# Altium schematic sheet STM32.SchDoc
size 368 x 200 mm; SheetNumber: 1; SheetTotal: 2
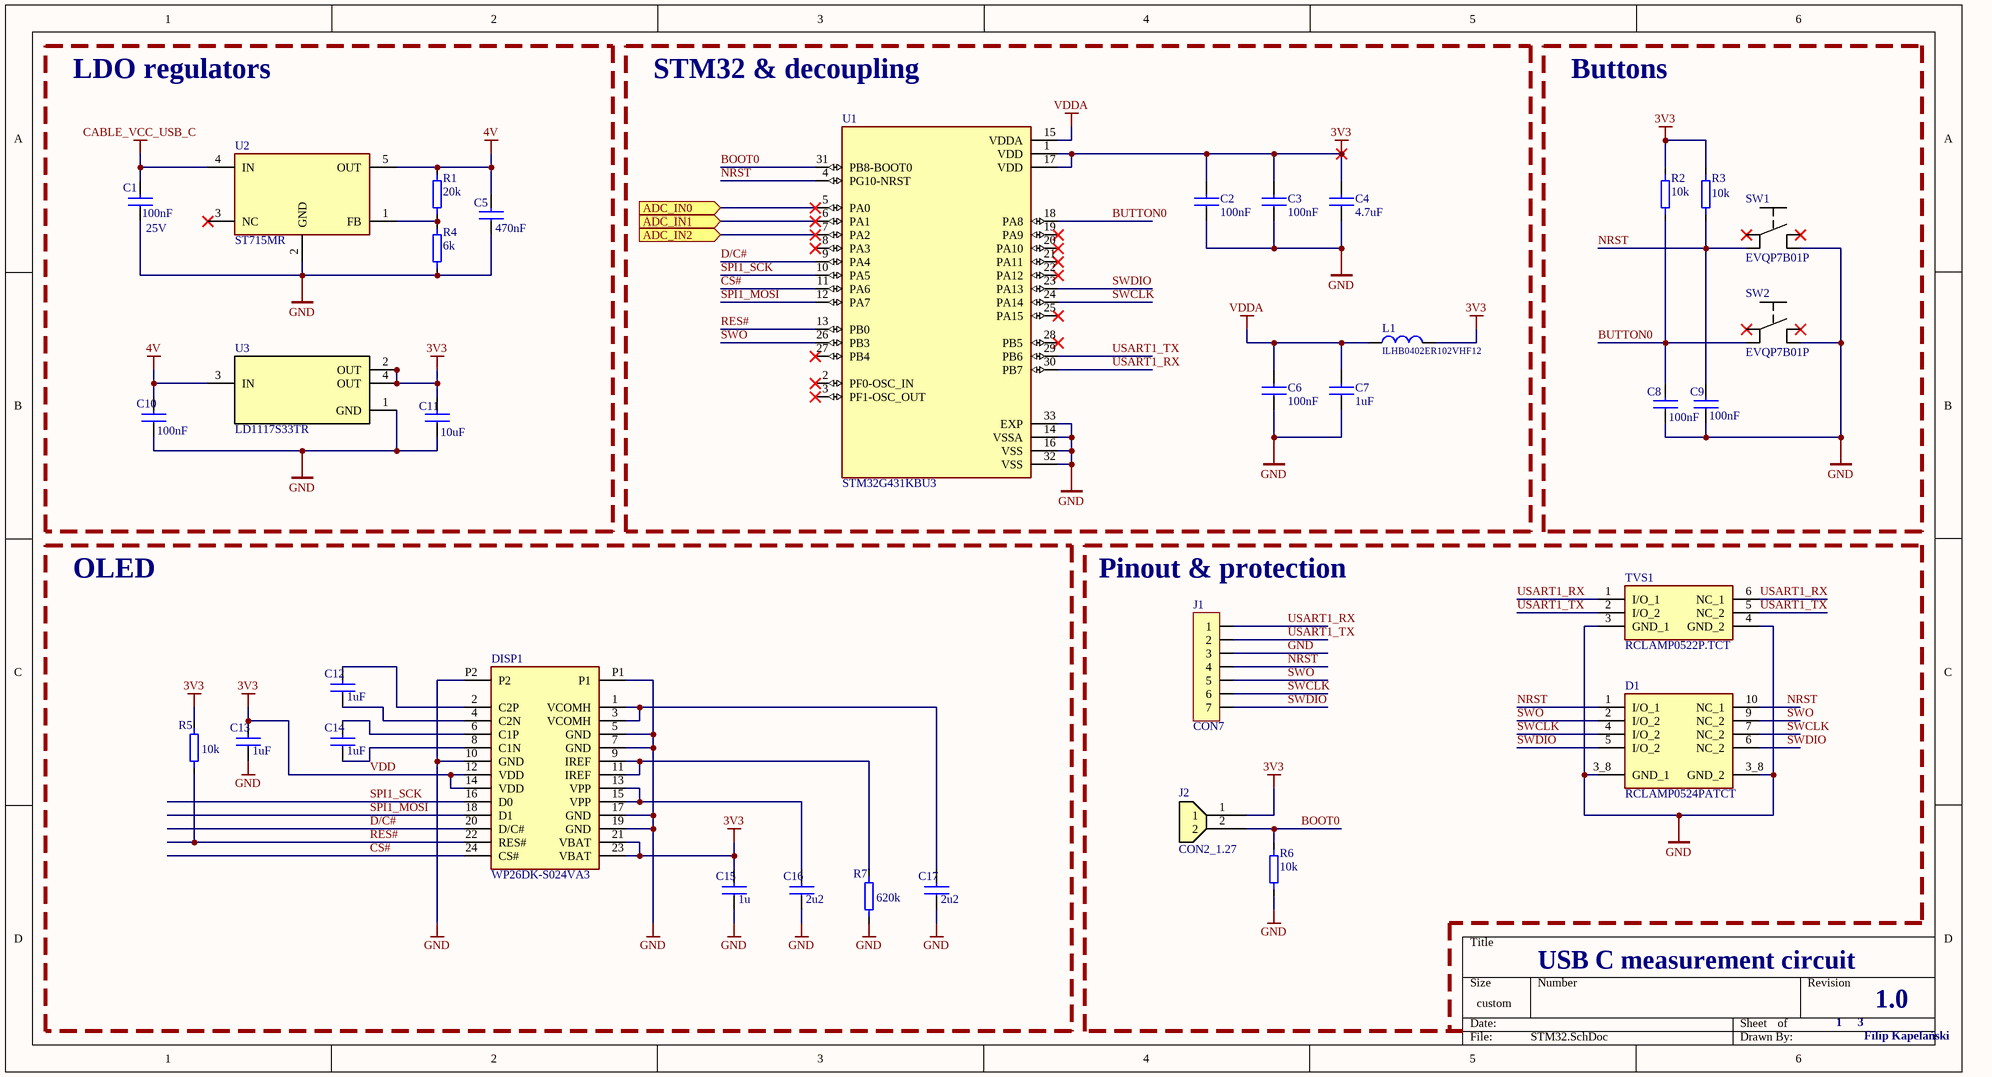
[diagram p0: STM32.SchDoc]

## Parts
C1  100nF  Voltage: 25V  [C0402]
C2  100nF  [C0402]
C3  100nF  [C0402]
C4  4.7uF  [C0402]
C5  470nF  [C0402]
C6  100nF  [C0402]
C7  1uF  [C0402]
C8  100nF  [C0402]
C9  100nF  [C0402]
C10  100nF  [C0402]
C11  10uF  [C0402]
C12  1uF  [C0402]
C13  1uF  [C0402]
C14  1uF  [C0402]
C15  1u  [C0603]
C16  2u2  [C0402]
C17  2u2  [C0402]
D1  RCLAMP0524PATCT  [DIO_RCLAMP0524PATCT]
DISP1  WP26DK-S024VA3  [WP26DK-S024VA3]
J1  CON7  [SIP7]
J2  CON2_1.27  [CON2_1.27]
L1  ILHB0402ER102VHF12  [L0402]
R1  20k  [R0805]
R2  10k  [R0402]
R3  10k  [R0402]
R4  6k  [R0805]
R5  10k  [R0402]
R6  10k  [R0402]
R7  620k  [R0402]
SW1  EVQP7B01P  [EVQP7B01P]
SW2  EVQP7B01P  [EVQP7B01P]
TVS1  RCLAMP0522P.TCT  [RCLAMP0522PTCT]
U1  STM32G431KBU3  [STM32G431KBU3]
U2  ST715MR  [ST715MR]
U3  LD1117S33TR  [LD1117S33TR]

## Blocks framed on the sheet
LDO regulators: C1 C5 C10 C11 R1 R4 U2 U3
STM32 & decoupling: C2-C4 C6 C7 L1 U1
Buttons: C8 C9 R2 R3 SW1 SW2
OLED: C12-C17 DISP1 R5 R7

## Ports
ADC_IN0 (in, see MeasurementCircuit[3A]), ADC_IN1 (in, see MeasurementCircuit[1D]), ADC_IN2 (in, see MeasurementCircuit[2D])

## Nets
4V: C5.2 C10.2 R1.1 U2.5(OUT) U3.3(IN)
CABLE_VCC_USB_C: C1.2 U2.4(IN)
GND: C1.1 C2.1 C3.1 C4.1 C5.1 C6.1 C7.1 C8.1 C9.1 C10.1 C11.1 C13.1 C15.1 C16.1 C17.1 D1.3_8(GND_1) DISP1.5(GND) DISP1.7(GND) DISP1.10(GND) DISP1.17(GND) DISP1.19(GND) DISP1.P1 DISP1.P2 J1.3 R4.2 R6.1 R7.2 SW1.2(S) SW2.2(S) TVS1.3(GND_1) TVS1.4(GND_2) U1.14(VSSA) U1.16(VSS) U1.32(VSS) U1.33(EXP) U2.2(GND) U3.1(GND)
VDD: C2.2 C3.2 C4.2 C11.2 C13.2 C15.2 DISP1.12(VDD) DISP1.14(VDD) DISP1.21(VBAT) DISP1.23(VBAT) J2.1 L1.1 R2.1 R3.1 R5.1 U1.1(VDD) U1.17(VDD) U3.2(OUT) U3.4(OUT)  [also labelled 3V3]
VDDA: C6.2 C7.2 L1.2 U1.15(VDDA)
ADC_IN0: U1.5(PA0) ; port ADC_IN0
ADC_IN1: U1.6(PA1) ; port ADC_IN1
ADC_IN2: U1.7(PA2) ; port ADC_IN2
BOOT0: J2.2 R6.2 U1.31(PB8-BOOT0)
BUTTON0: C8.2 R2.2 SW2.1(P) U1.18(PA8)
CS#: DISP1.24(CS#) U1.11(PA6)
D/C#: DISP1.20(D/C#) U1.9(PA4)
NRST: C9.2 D1.1(I/O_1) D1.10(NC_1) J1.4 R3.2 SW1.1(P) U1.4(PG10-NRST)
RES#: DISP1.22(RES#) R5.2 U1.13(PB0)
SPI1_MOSI: DISP1.18(D1) U1.12(PA7)
SPI1_SCK: DISP1.16(D0) U1.10(PA5)
SWCLK: D1.4(I/O_2) D1.7(NC_2) J1.6 U1.24(PA14)
SWDIO: D1.5(I/O_2) D1.6(NC_2) J1.7 U1.23(PA13)
SWO: D1.2(I/O_2) D1.9(NC_2) J1.5 U1.26(PB3)
USART1_RX: J1.1 TVS1.1(I/O_1) TVS1.6(NC_1) U1.30(PB7)
USART1_TX: J1.2 TVS1.2(I/O_2) TVS1.5(NC_2) U1.29(PB6)
NetC12_1: C12.1 DISP1.4(C2N)
NetC12_2: C12.2 DISP1.2(C2P)
NetC14_1: C14.1 DISP1.8(C1N)
NetC14_2: C14.2 DISP1.6(C1P)
NetC16_2: C16.2 DISP1.13(VPP) DISP1.15(VPP)
NetC17_2: C17.2 DISP1.1(VCOMH) DISP1.3(VCOMH)
NetDISP1_9: DISP1.9(IREF) DISP1.11(IREF) R7.1
NetR1_2: R1.2 R4.1 U2.1(FB)

Not connected (* = marked no-connect by the designer): SW1 1'(P1)* 2'(S1)*; SW2 1'(P1)* 2'(S1)*; U1 2(PF0-OSC_IN)* 3(PF1-OSC_OUT)* 8(PA3)* 19(PA9)* 20(PA10)* 21(PA11)* 22(PA12)* 25(PA15)* 27(PB4)* 28(PB5)*; U2 3(NC)*

## Notes on the sheet
- (near J1) Pinout & protection
- USB C measurement circuit
- 1
- 3
- 1.0
- Filip Kapelański

## Library data of the parts
C1-C17 = C: Kondensator ceramiczny SMD; Supplier: *; SupplierURL: *; helpurl: *; Manufacturer: *; PartNumber: *; Price: *; Symbol: *; Package: *
  C1: Value: 100nF
  C2 C3 C6 C8-C10: Voltage: *; Value: 100nF
  C4: Voltage: *; Value: 4.7uF
  C5: Voltage: *; Value: 470nF
  C7 C12-C14: Voltage: *; Value: 1uF
  C11: Voltage: *; Value: 10uF
  C15: Voltage: *; Value: 1u
  C16 C17: Voltage: *; Value: 2u2
D1 = RCLAMP0524PATCT: 15V Clamp 5A (8/20Âµs) Ipp Tvs Diode Surface Mount SLP2510P8; MF: Semtech Corporation; SnapEDA_Link: https://www.snapeda.com/parts/RCLAMP0524PATCT/Semtech+Corporation/view-part/?ref=snap; Package: UFDFN-10 Semtech; Value: *; MP: RCLAMP0524PATCT; Check_prices: https://www.snapeda.com/parts/RCLAMP0524PATCT/Semtech+Corporation/view-part/?ref=eda
J1 = CON7: Connector
J2 = CON2_1.27: Złącze: kołkowe; listwa kołkowa; męskie; PIN: 2; THT; proste; 1,27mm
L1 = L: Cewka/Koralik ferrytowy; Supplier: *; SupplierURL: *; helpurl: *; Manufacturer: *; Package: *; PartNumber: *; Price: *; Symbol: *; Value: ILHB0402ER102VHF12
R1-R7 = R: Rezystor SMD; Supplier: *; SupplierURL: *; helpurl: *; Manufacturer: *; PartNumber: *; Price: *; Symbol: *; Package: *
  R1: Value: 20k
  R2 R3 R5 R6: Value: 10k
  R4: Value: 6k
  R7: Value: 620k
SW1 SW2 = EVQP7B01P: Switch Tactile N.O. SPST Rectangular Button J-Bend 0.05A 12VDC 2.2N SMD T/R
TVS1 = RCLAMP0522P.TCT: TVS Diode (Bi-directional); Manufacturer_Name: SEMTECH; Datasheet Link: https://www.digikey.ph/en/products/detail/semtech-corporation/RCLAMP0522P-TCT/5113632; Height: 0.65mm; Manufacturer_Part_Number: RCLAMP0522P.TCT; Mouser Part Number: 947-RCLAMP0522P.TCT; Mouser Price/Stock: https://www.mouser.co.uk/ProductDetail/Semtech/RCLAMP0522P.TCT?qs=rBWM4%252BvDhIdKBWbIaH8MsA%3D%3D; Arrow Part Number: RCLAMP0522P.TCT; Arrow Price/Stock: https://www.arrow.com/en/products/rclamp0522p.tct/semtech?utm_currency=USD&region=nac
U1 = STM32G431KBU3: ARM® Cortex®-M4F STM32G4 Microcontroller IC 32-Bit Single-Core 170MHz 128KB (128K x 8) FLASH 32-UFQFPN (5x5); ComponentLink1Description: New link; ComponentLink1URL: https://www.mouser.pl/ProductDetail/STMicroelectronics/STM32G431KBU3?qs=PzGy0jfpSMtowkKWTRQBRw%3D%3D
U2 = ST715MR: Linear Voltage Regulator IC Positive Adjustable 1 Output 85mA SOT-23-5
U3 = LD1117S33TR: Linear Voltage Regulator IC Positive Fixed 1 Output 800mA SOT-223